# EAGLE schematic SSR 16 Output (EAGLE 7.6.0)
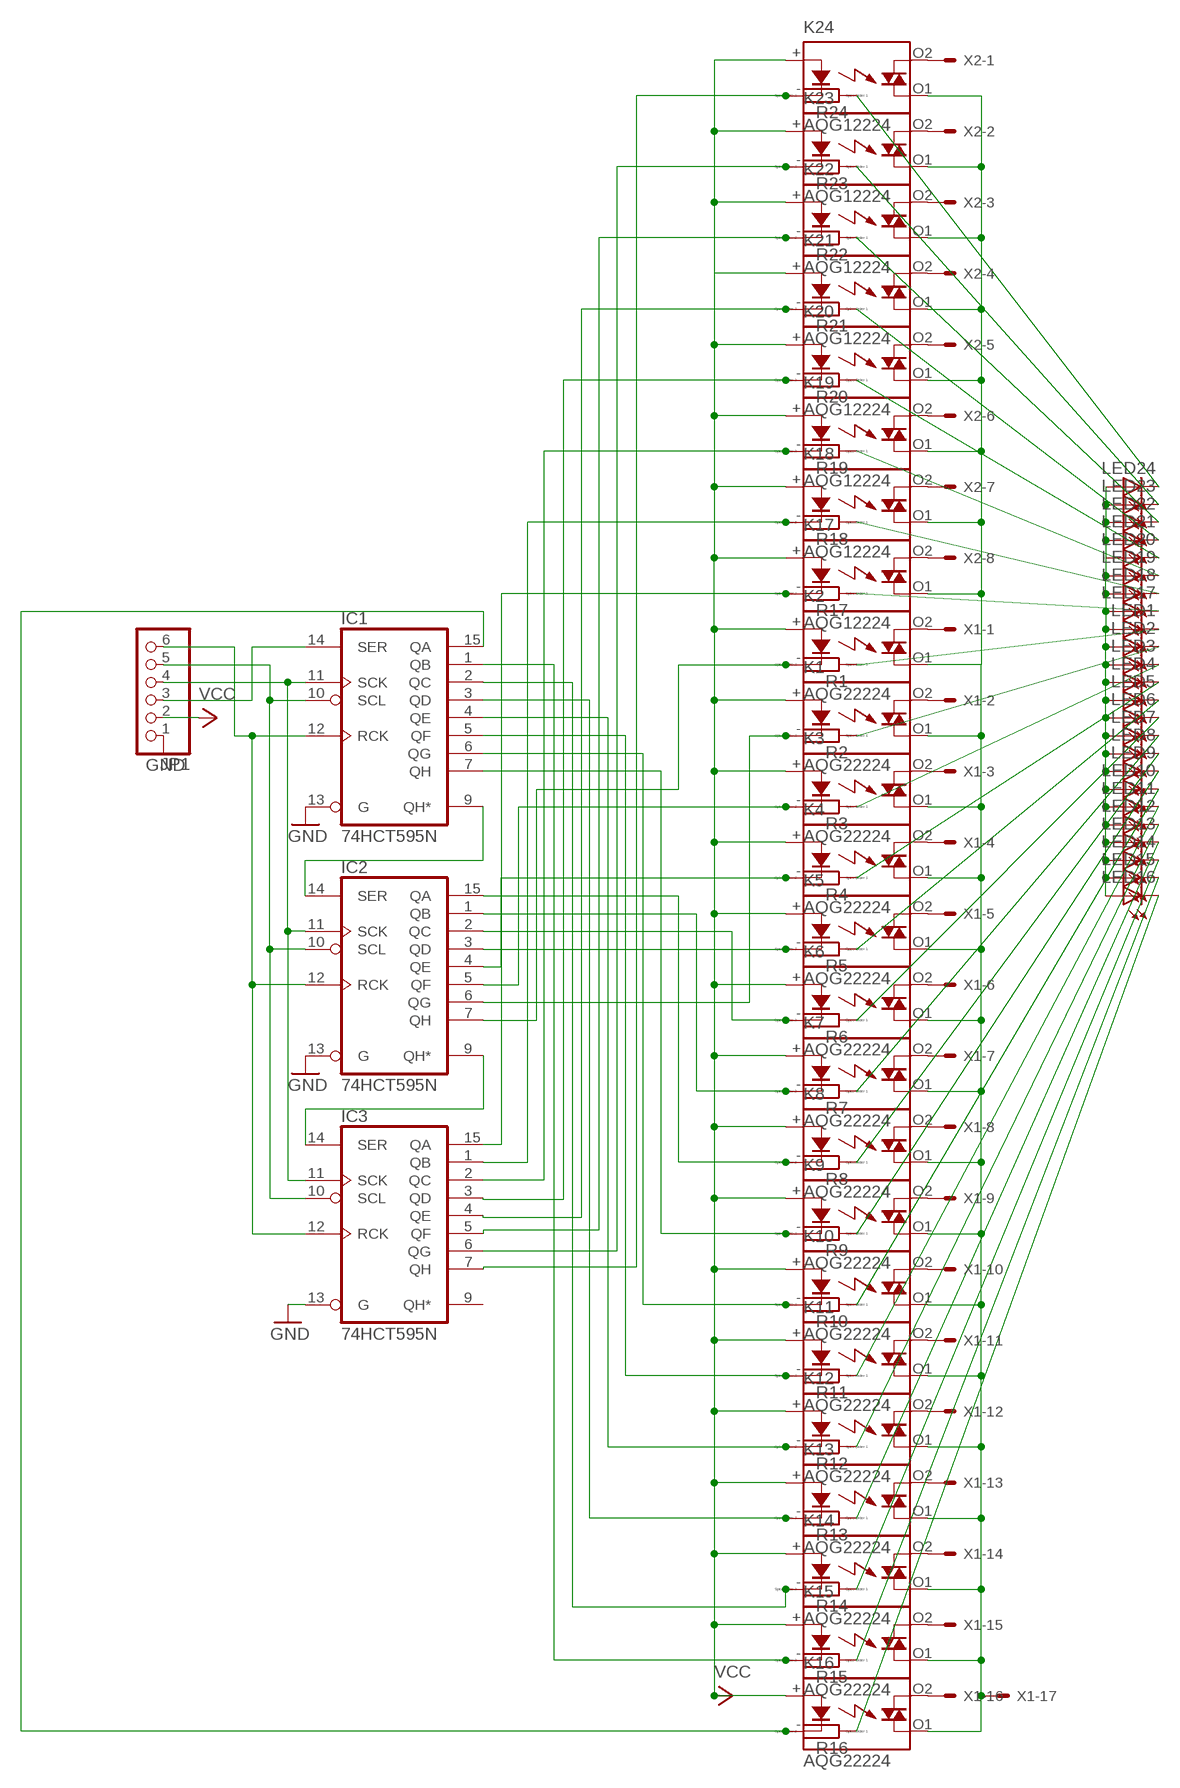
[diagram p0: schematic, sheet 1]

## Parts
IC1  74HCT595N  [DIL16]
IC2  74HCT595N  [DIL16]
IC3  74HCT595N  [DIL16]
JP1  PINHD-1X6  [1X06]
K1  AQG22224  [AQG]
K2  AQG22224  [AQG]
K3  AQG22224  [AQG]
K4  AQG22224  [AQG]
K5  AQG22224  [AQG]
K6  AQG22224  [AQG]
K7  AQG22224  [AQG]
K8  AQG22224  [AQG]
K9  AQG22224  [AQG]
K10  AQG22224  [AQG]
K11  AQG22224  [AQG]
K12  AQG22224  [AQG]
K13  AQG22224  [AQG]
K14  AQG22224  [AQG]
K15  AQG22224  [AQG]
K16  AQG22224  [AQG]
K17  AQG12224  [AQG]
K18  AQG12224  [AQG]
K19  AQG12224  [AQG]
K20  AQG12224  [AQG]
K21  AQG12224  [AQG]
K22  AQG12224  [AQG]
K23  AQG12224  [AQG]
K24  AQG12224  [AQG]
LED1  LED5MM  [LED5MM]
LED2  LED5MM  [LED5MM]
LED3  LED5MM  [LED5MM]
LED4  LED5MM  [LED5MM]
LED5  LED5MM  [LED5MM]
LED6  LED5MM  [LED5MM]
LED7  LED5MM  [LED5MM]
LED8  LED5MM  [LED5MM]
LED9  LED5MM  [LED5MM]
LED10  LED5MM  [LED5MM]
LED11  LED5MM  [LED5MM]
LED12  LED5MM  [LED5MM]
LED13  LED5MM  [LED5MM]
LED14  LED5MM  [LED5MM]
LED15  LED5MM  [LED5MM]
LED16  LED5MM  [LED5MM]
LED17  LED5MM  [LED5MM]
LED18  LED5MM  [LED5MM]
LED19  LED5MM  [LED5MM]
LED20  LED5MM  [LED5MM]
LED21  LED5MM  [LED5MM]
LED22  LED5MM  [LED5MM]
LED23  LED5MM  [LED5MM]
LED24  LED5MM  [LED5MM]
R1  R0204/7  [0204/7]
R2  R0204/7  [0204/7]
R3  R0204/7  [0204/7]
R4  R0204/7  [0204/7]
R5  R0204/7  [0204/7]
R6  R0204/7  [0204/7]
R7  R0204/7  [0204/7]
R8  R0204/7  [0204/7]
R9  R0204/7  [0204/7]
R10  R0204/7  [0204/7]
R11  R0204/7  [0204/7]
R12  R0204/7  [0204/7]
R13  R0204/7  [0204/7]
R14  R0204/7  [0204/7]
R15  R0204/7  [0204/7]
R16  R0204/7  [0204/7]
R17  R0204/7  [0204/7]
R18  R0204/7  [0204/7]
R19  R0204/7  [0204/7]
R20  R0204/7  [0204/7]
R21  R0204/7  [0204/7]
R22  R0204/7  [0204/7]
R23  R0204/7  [0204/7]
R24  R0204/7  [0204/7]
X1  KK-156-17  [KK-156-17]
X2  KK-156-8  [KK-156-8]

## Nets
GND: IC1.13(G) IC2.13(G) IC3.13(G) JP1.1
N$1: IC1.9(QH*) IC2.14(SER)
N$2: IC1.11(SCK) IC2.11(SCK) IC3.11(SCK) JP1.4
N$3: IC1.10(SCL) IC2.10(SCL) IC3.10(SCL) JP1.5
N$4: IC1.12(RCK) IC2.12(RCK) IC3.12(RCK) JP1.6
N$5: LED1.K(C) R1.1
N$6: IC1.15(QA) K16.-(K) R16.2
N$7: IC1.1(QB) K15.-(K) R15.2
N$8: IC1.2(QC) K14.-(K) R14.2
N$9: IC1.3(QD) K13.-(K) R13.2
N$10: IC1.4(QE) K12.-(K) R12.2
N$11: IC1.5(QF) K11.-(K) R11.2
N$12: IC1.6(QG) K10.-(K) R10.2
N$13: IC1.7(QH) K9.-(K) R9.2
N$14: IC2.15(QA) K8.-(K) R8.2
N$15: IC2.1(QB) K7.-(K) R7.2
N$16: IC2.2(QC) K6.-(K) R6.2
N$17: IC2.3(QD) K5.-(K) R5.2
N$18: IC2.4(QE) K4.-(K) R4.2
N$19: IC2.5(QF) K3.-(K) R3.2
N$20: IC2.6(QG) K1.-(K) R2.2
N$21: LED2.K(C) R2.1
N$22: IC1.14(SER) JP1.3
N$23: K1.O1(DS2) K2.O1(DS2) K3.O1(DS2) K4.O1(DS2) K5.O1(DS2) K6.O1(DS2) K7.O1(DS2) K8.O1(DS2) K9.O1(DS2) K10.O1(DS2) K11.O1(DS2) K12.O1(DS2) K13.O1(DS2) K14.O1(DS2) K15.O1(DS2) K16.O1(DS2) K17.O1(DS2) K18.O1(DS2) K19.O1(DS2) K20.O1(DS2) K21.O1(DS2) K22.O1(DS2) K23.O1(DS2) K24.O1(DS2) X1.17
N$24: K16.O2(DS1) X1.16
N$25: K15.O2(DS1) X1.15
N$26: K14.O2(DS1) X1.14
N$27: K13.O2(DS1) X1.13
N$28: K12.O2(DS1) X1.12
N$29: K11.O2(DS1) X1.11
N$30: K10.O2(DS1) X1.10
N$31: K9.O2(DS1) X1.9
N$32: K8.O2(DS1) X1.8
N$33: K7.O2(DS1) X1.7
N$34: K6.O2(DS1) X1.6
N$35: K5.O2(DS1) X1.5
N$36: K4.O2(DS1) X1.4
N$37: K3.O2(DS1) X1.3
N$38: K1.O2(DS1) X1.2
N$39: K2.O2(DS1) X1.1
N$40: IC2.7(QH) K2.-(K) R1.2
N$41: LED3.K(C) R3.1
N$42: LED4.K(C) R4.1
N$43: LED5.K(C) R5.1
N$44: LED6.K(C) R6.1
N$45: LED7.K(C) R7.1
N$46: LED8.K(C) R8.1
N$47: LED9.K(C) R9.1
N$48: LED10.K(C) R10.1
N$49: LED11.K(C) R11.1
N$50: LED12.K(C) R12.1
N$51: LED13.K(C) R13.1
N$52: LED14.K(C) R14.1
N$53: LED15.K(C) R15.1
N$54: LED16.K(C) R16.1
N$60: IC2.9(QH*) IC3.14(SER)
N$61: IC3.15(QA) K17.-(K) R17.2
N$62: LED17.K(C) R17.1
N$63: IC3.1(QB) K18.-(K) R18.2
N$64: LED18.K(C) R18.1
N$65: IC3.2(QC) K19.-(K) R19.2
N$66: LED19.K(C) R19.1
N$67: IC3.3(QD) K20.-(K) R20.2
N$68: LED20.K(C) R20.1
N$69: IC3.4(QE) K21.-(K) R21.2
N$70: LED21.K(C) R21.1
N$71: IC3.5(QF) K22.-(K) R22.2
N$72: LED22.K(C) R22.1
N$73: K17.O2(DS1) X2.8
N$74: K18.O2(DS1) X2.7
N$75: K19.O2(DS1) X2.6
N$76: K20.O2(DS1) X2.5
N$77: K21.O2(DS1) X2.4
N$78: K22.O2(DS1) X2.3
N$79: K23.O2(DS1) X2.2
N$80: K24.O2(DS1) X2.1
N$81: LED1.A LED2.A LED3.A LED4.A LED5.A LED6.A LED7.A LED8.A LED9.A LED10.A LED11.A LED12.A LED13.A LED14.A LED15.A LED16.A LED17.A LED18.A LED19.A LED20.A LED21.A LED22.A LED23.A LED24.A
N$82: IC3.6(QG) K23.-(K) R23.2
N$83: IC3.7(QH) K24.-(K) R24.2
N$84: LED23.K(C) R23.1
N$85: LED24.K(C) R24.1
VCC: JP1.2 K1.+(A) K2.+(A) K3.+(A) K4.+(A) K5.+(A) K6.+(A) K7.+(A) K8.+(A) K9.+(A) K10.+(A) K11.+(A) K12.+(A) K13.+(A) K14.+(A) K15.+(A) K16.+(A) K17.+(A) K18.+(A) K19.+(A) K20.+(A) K21.+(A) K22.+(A) K23.+(A) K24.+(A)
Unconnected: IC3.9(QH*)

## Power pins joined to a net without a drawn wire
GND: IC1.8(GND) IC2.8(GND) IC3.8(GND)
VCC: IC1.16(VCC) IC2.16(VCC) IC3.16(VCC)

## Library data of the parts
IC1-IC3 = 74xx-eu:74*595: 8-bit SHIFT REGISTER, output latch
JP1 = pinhead:PINHD-1X6: PIN HEADER
K1-K16 = relay:AQG*: SOLID STATE RELAY NAiS Zero-cross, Non zero-cross Source: http://www.mew-europe.com/.. en_ds_61611_0000.pdf; MPN: AQG22224; OC_FARNELL: unknown; OC_NEWARK: 11N2589
K17-K24 = relay:AQG*: SOLID STATE RELAY NAiS Zero-cross, Non zero-cross Source: http://www.mew-europe.com/.. en_ds_61611_0000.pdf; MPN: AQG12224; OC_FARNELL: unknown; OC_NEWARK: 11N2584
LED1-LED24 = led:LED: LED OSRAM: - CHIPLED LG R971, LG N971, LY N971, LG Q971, LY Q971, LO R971, LY R971 LH N974, LH R974 LS Q976, LO Q976, LY Q976 LO Q996 - Hyper CHIPLED LW Q18S LB Q993, LB Q99A, LB R99A - SideLED LS A670, LO A670, LY A670, LG A670, LP A670 LB A673, LV A673, LT A673, LW A673 LH A674 LY A675 LS A676, LA A676, LO A676, LY A676, LW A676 LS A679, LY A679, LG A679 - Hyper Micro SIDELED® LS Y876, LA Y876, LO Y876, LY Y876 LT Y87S - SmartLED LW L88C, LW L88S LB L89C, LB L89S, LG L890 LS L89K, LO L89K, LY L89K LS L896, LA L896, LO L896, LY L896 - TOPLED LS T670, LO T670, LY T670, LG T670, LP T670 LSG T670, LSP T670, LSY T670, LOP T670, LYG T670 LG T671, LOG T671, LSG T671 LB T673, LV T673, LT T673, LW T673 LH T674 LS T676, LA T676, LO T676, LY T676, LB T676, LH T676, LSB T676, LW T676 LB T67C, LV T67C, LT T67C, LS T67K, LO T67K, LY T67K, LW E67C LS E67B, LA E67B, LO E67B, LY E67B, LB E67C, LV E67C, LT E67C LW T67C LS T679, LY T679, LG T679 LS T770, LO T770, LY T770, LG T770, LP T770 LB T773, LV T773, LT T773, LW T773 LH T774 LS E675, LA E675, LY E675, LS T675 LS T776, LA T776, LO T776, LY T776, LB T776 LHGB T686 LT T68C, LB T68C - Hyper Mini TOPLED® LB M676 - Mini TOPLED Santana® LG M470 LS M47K, LO M47K, LY M47K Source: http://www.osram.convergy.de LUXEON: - LUMILED® LXK2-PW12-R00, LXK2-PW12-S00, LXK2-PW14-U00, LXK2-PW14-V00 LXK2-PM12-R00, LXK2-PM12-S00, LXK2-PM14-U00 LXK2-PE12-Q00, LXK2-PE12-R00, LXK2-PE12-S00, LXK2-PE14-T00, LXK2-PE14-U00 LXK2-PB12-K00, LXK2-PB12-L00, LXK2-PB12-M00, LXK2-PB14-N00, LXK2-PB14-P00, LXK2-PB14-Q00 LXK2-PR12-L00, LXK2-PR12-M00, LXK2-PR14-Q00, LXK2-PR14-R00 LXK2-PD12-Q00, LXK2-PD12-R00, LXK2-PD12-S00 LXK2-PH12-R00, LXK2-PH12-S00 LXK2-PL12-P00, LXK2-PL12-Q00, LXK2-PL12-R00 Source: www.luxeon.com KINGBRIGHT: KA-3528ASYC Source: www.kingbright.com
R1-R24 = eagle-ltspice:R: RESISTOR, European symbol; SPICEMODEL: NONE; SPICEPREFIX: R
X1 = con-molex:KK-156-17: KK 156 HEADER Source: http://www.molex.com/pdm_docs/sd/026604100_sd.pdf; OC_FARNELL: unknown; OC_NEWARK: unknown
X2 = con-molex:KK-156-8: KK 156 HEADER Source: http://www.molex.com/pdm_docs/sd/026604100_sd.pdf; OC_FARNELL: unknown; OC_NEWARK: unknown